# Altium schematic sheet 0.CONNECTOR.SchDoc
size A3
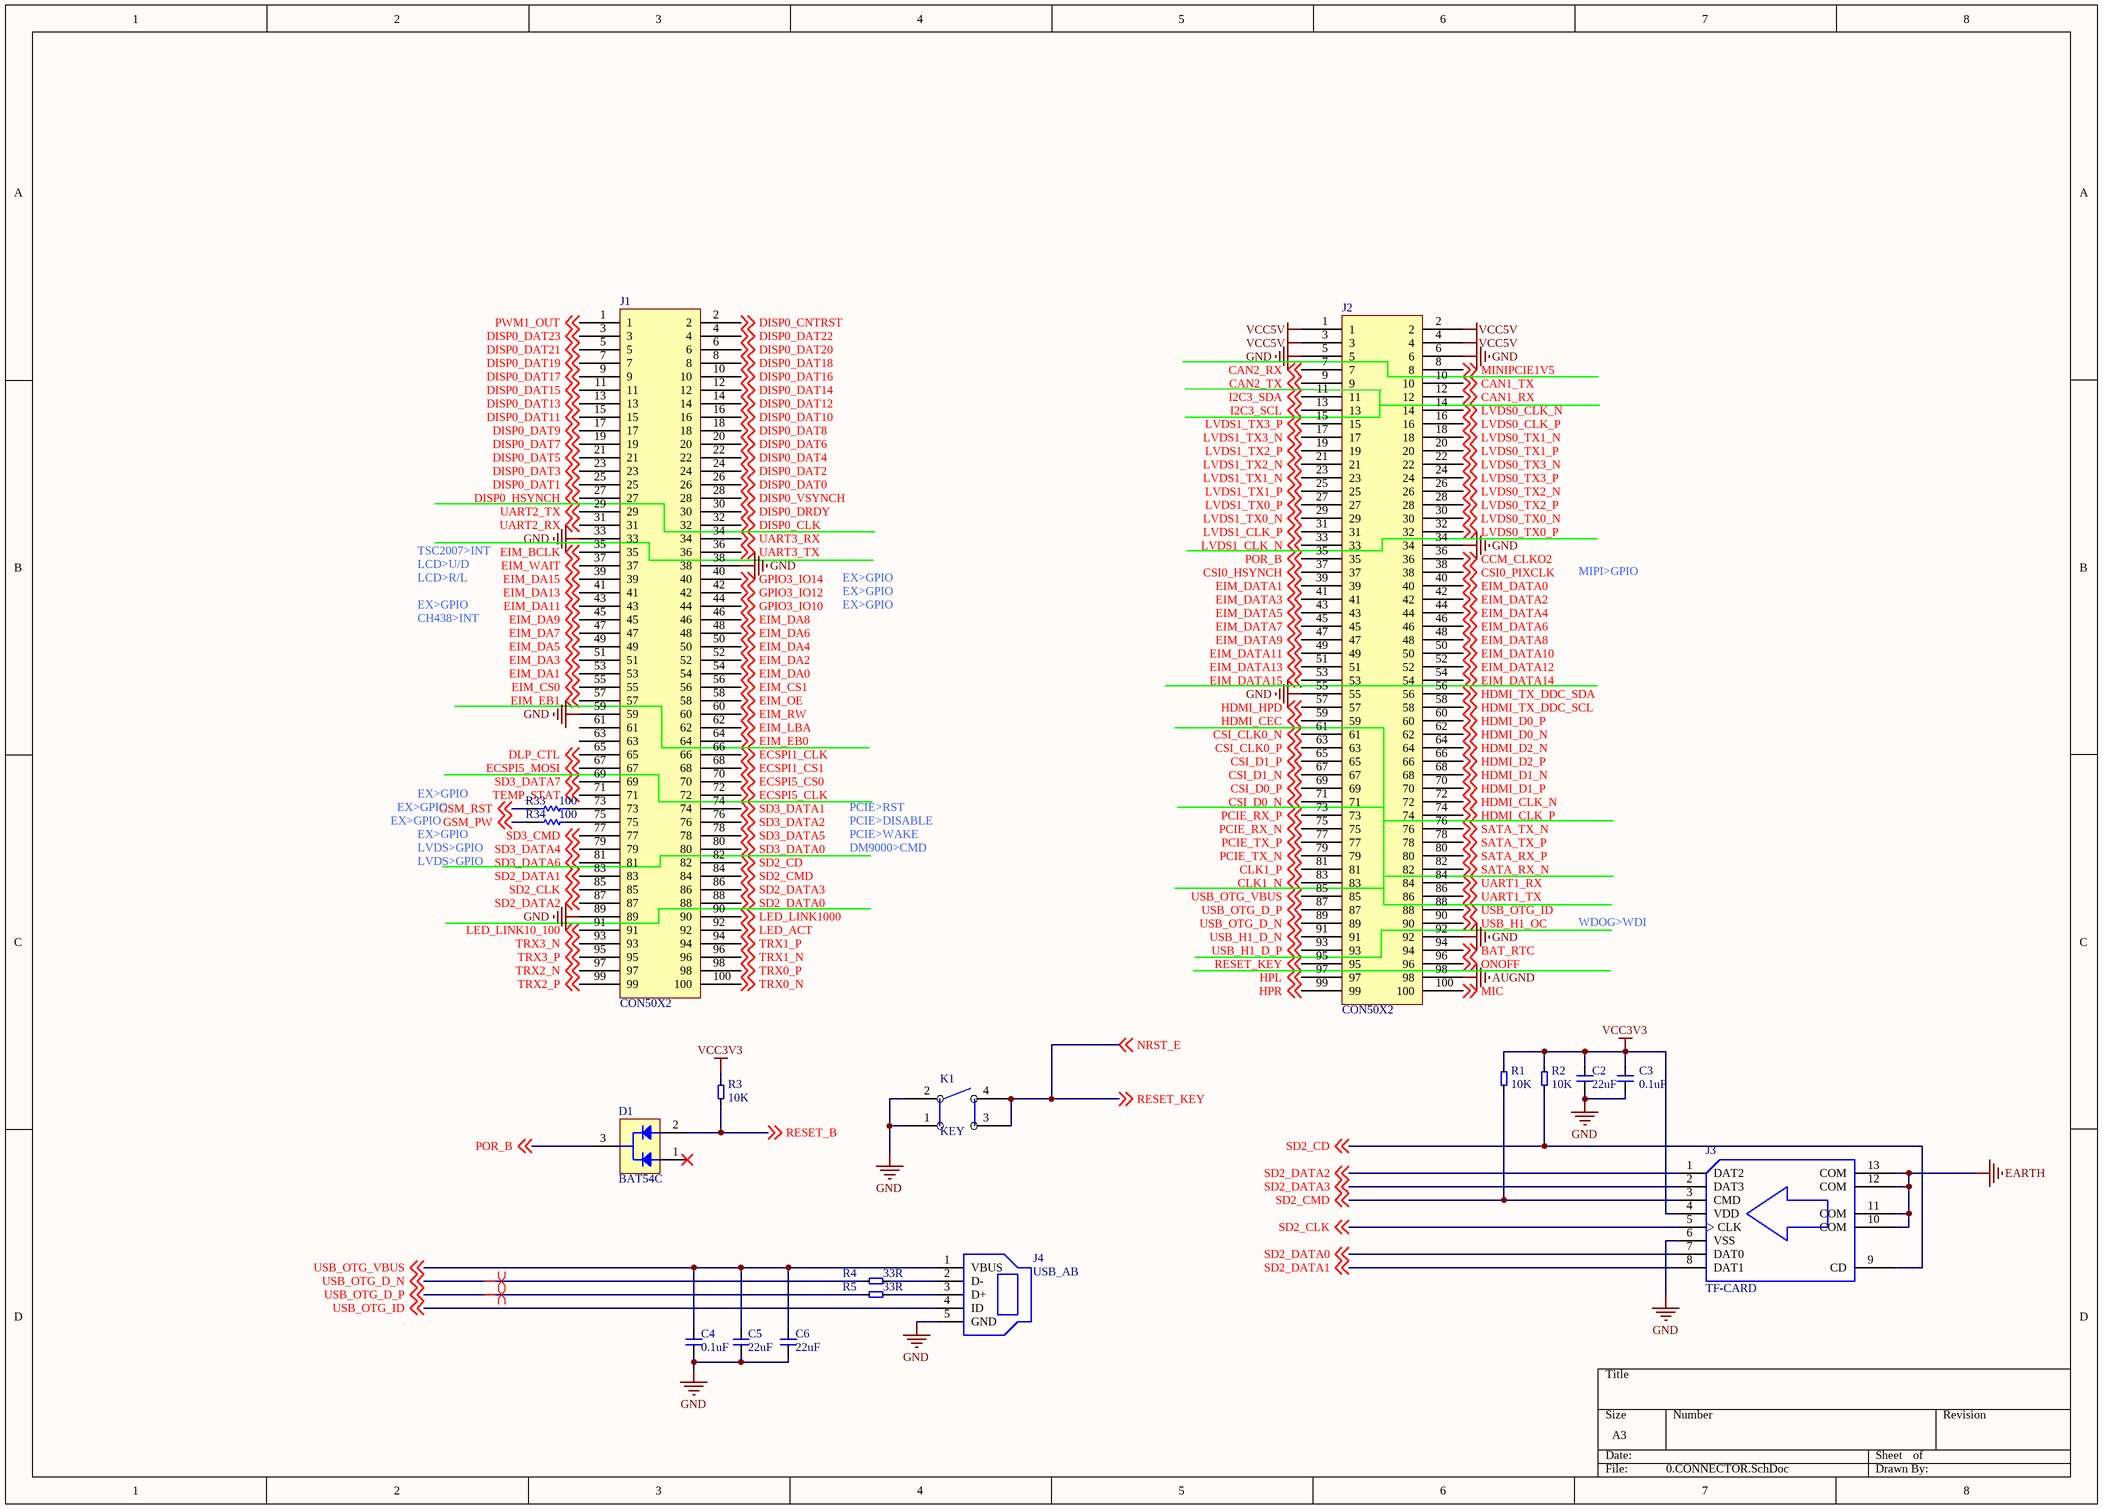
[diagram p0: 0.CONNECTOR.SchDoc]

## Parts
C2  22uF  [0603C]
C3  0.1uF  [0603C]
C4  0.1uF  [0603C]
C5  22uF  [0603C]
C6  22uF  [0603C]
D1  BAT54C  [SOT-23]
J1  CON50X2  [IDC50X2-1.27MM_SMT]
J2  CON50X2  [IDC50X2-1.27MM_SMT]
J3  TF-CARD  [TF-CARD]
J4  USB_AB  [MINI USB B]
K1  KEY  [SS-SPB-4.5]
R1  10K  [0603R]
R2  10K  [0603R]
R3  10K  [0603R]
R4  33R  [0603R]
R5  33R  [0603R]
R33  value 100  [0603]  (hidden comment: Res1)
R34  value 100  [0603]  (hidden comment: Res1)

## Nets
AUGND: J2.98
EARTH: J3.10(COM) J3.11(COM) J3.12(COM) J3.13(COM) J4.6(9) J4.7(9) J4.8(9) J4.9
GND: C2.1 C3.1 C4.1 C5.1 C6.1 J1.33 J1.38 J1.59 J1.89 J2.5 J2.6 J2.34 J2.55 J2.92 J3.6(VSS) J4.5(GND) K1.1 K1.2
VCC3V3: C2.2 C3.2 J3.4(VDD) R1.2 R2.2 R3.2
VCC5V: J2.1 J2.2 J2.3 J2.4
BAT_RTC: J2.94 ; off-sheet BAT_RTC
CAN1_RX: J2.12 ; off-sheet CAN1_RX
CAN1_TX: J2.10 ; off-sheet CAN1_TX
CAN2_RX: J2.7 ; off-sheet CAN2_RX
CAN2_TX: J2.9 ; off-sheet CAN2_TX
CCM_CLKO2: J2.36 ; off-sheet CCM_CLKO2
CLK1_N: J2.83 ; off-sheet CLK1_N
CLK1_P: J2.81 ; off-sheet CLK1_P
CSI0_HSYNCH: J2.37 ; off-sheet CSI0_HSYNCH
CSI0_PIXCLK: J2.38 ; off-sheet CSI0_PIXCLK
CSI_CLK0_N: J2.61 ; off-sheet CSI_CLK0_N
CSI_CLK0_P: J2.63 ; off-sheet CSI_CLK0_P
CSI_D0_N: J2.71 ; off-sheet CSI_D0_N
CSI_D0_P: J2.69 ; off-sheet CSI_D0_P
CSI_D1_N: J2.67 ; off-sheet CSI_D1_N
CSI_D1_P: J2.65 ; off-sheet CSI_D1_P
DISP0_CLK: J1.32 ; off-sheet DISP0_CLK
DISP0_CNTRST: J1.2 ; off-sheet DISP0_CNTRST
DISP0_DAT0: J1.26 ; off-sheet DISP0_DAT0
DISP0_DAT1: J1.25 ; off-sheet DISP0_DAT1
DISP0_DAT2: J1.24 ; off-sheet DISP0_DAT2
DISP0_DAT3: J1.23 ; off-sheet DISP0_DAT3
DISP0_DAT4: J1.22 ; off-sheet DISP0_DAT4
DISP0_DAT5: J1.21 ; off-sheet DISP0_DAT5
DISP0_DAT6: J1.20 ; off-sheet DISP0_DAT6
DISP0_DAT7: J1.19 ; off-sheet DISP0_DAT7
DISP0_DAT8: J1.18 ; off-sheet DISP0_DAT8
DISP0_DAT9: J1.17 ; off-sheet DISP0_DAT9
DISP0_DAT10: J1.16 ; off-sheet DISP0_DAT10
DISP0_DAT11: J1.15 ; off-sheet DISP0_DAT11
DISP0_DAT12: J1.14 ; off-sheet DISP0_DAT12
DISP0_DAT13: J1.13 ; off-sheet DISP0_DAT13
DISP0_DAT14: J1.12 ; off-sheet DISP0_DAT14
DISP0_DAT15: J1.11 ; off-sheet DISP0_DAT15
DISP0_DAT16: J1.10 ; off-sheet DISP0_DAT16
DISP0_DAT17: J1.9 ; off-sheet DISP0_DAT17
DISP0_DAT18: J1.8 ; off-sheet DISP0_DAT18
DISP0_DAT19: J1.7 ; off-sheet DISP0_DAT19
DISP0_DAT20: J1.6 ; off-sheet DISP0_DAT20
DISP0_DAT21: J1.5 ; off-sheet DISP0_DAT21
DISP0_DAT22: J1.4 ; off-sheet DISP0_DAT22
DISP0_DAT23: J1.3 ; off-sheet DISP0_DAT23
DISP0_DRDY: J1.30 ; off-sheet DISP0_DRDY
DISP0_HSYNCH: J1.27 ; off-sheet DISP0_HSYNCH
DISP0_VSYNCH: J1.28 ; off-sheet DISP0_VSYNCH
DLP_CTL: J1.65 ; off-sheet DLP_CTL
ECSPI1_CLK: J1.66 ; off-sheet ECSPI1_CLK
ECSPI1_CS1: J1.68 ; off-sheet ECSPI1_CS1
ECSPI5_CLK: J1.72 ; off-sheet ECSPI5_CLK
ECSPI5_CS0: J1.70 ; off-sheet ECSPI5_CS0
ECSPI5_MOSI: J1.67 ; off-sheet ECSPI5_MOSI
EIM_BCLK: J1.35 ; off-sheet EIM_BCLK
EIM_CS0: J1.55 ; off-sheet EIM_CS0
EIM_CS1: J1.56 ; off-sheet EIM_CS1
EIM_DA0: J1.54 ; off-sheet EIM_DA0
EIM_DA1: J1.53 ; off-sheet EIM_DA1
EIM_DA2: J1.52 ; off-sheet EIM_DA2
EIM_DA3: J1.51 ; off-sheet EIM_DA3
EIM_DA4: J1.50 ; off-sheet EIM_DA4
EIM_DA5: J1.49 ; off-sheet EIM_DA5
EIM_DA6: J1.48 ; off-sheet EIM_DA6
EIM_DA7: J1.47 ; off-sheet EIM_DA7
EIM_DA8: J1.46 ; off-sheet EIM_DA8
EIM_DA9: J1.45 ; off-sheet EIM_DA9
EIM_DA11: J1.43 ; off-sheet EIM_DA11
EIM_DA13: J1.41 ; off-sheet EIM_DA13
EIM_DA15: J1.39 ; off-sheet EIM_DA15
EIM_DATA0: J2.40 ; off-sheet EIM_DATA0
EIM_DATA1: J2.39 ; off-sheet EIM_DATA1
EIM_DATA2: J2.42 ; off-sheet EIM_DATA2
EIM_DATA3: J2.41 ; off-sheet EIM_DATA3
EIM_DATA4: J2.44 ; off-sheet EIM_DATA4
EIM_DATA5: J2.43 ; off-sheet EIM_DATA5
EIM_DATA6: J2.46 ; off-sheet EIM_DATA6
EIM_DATA7: J2.45 ; off-sheet EIM_DATA7
EIM_DATA8: J2.48 ; off-sheet EIM_DATA8
EIM_DATA9: J2.47 ; off-sheet EIM_DATA9
EIM_DATA10: J2.50 ; off-sheet EIM_DATA10
EIM_DATA11: J2.49 ; off-sheet EIM_DATA11
EIM_DATA12: J2.52 ; off-sheet EIM_DATA12
EIM_DATA13: J2.51 ; off-sheet EIM_DATA13
EIM_DATA14: J2.54 ; off-sheet EIM_DATA14
EIM_DATA15: J2.53 ; off-sheet EIM_DATA15
EIM_EB0: J1.64 ; off-sheet EIM_EB0
EIM_EB1: J1.57 ; off-sheet EIM_EB1
EIM_LBA: J1.62 ; off-sheet EIM_LBA
EIM_OE: J1.58 ; off-sheet EIM_OE
EIM_RW: J1.60 ; off-sheet EIM_RW
EIM_WAIT: J1.37 ; off-sheet EIM_WAIT
GPIO3_IO10: J1.44 ; off-sheet GPIO3_IO10
GPIO3_IO12: J1.42 ; off-sheet GPIO3_IO12
GPIO3_IO14: J1.40 ; off-sheet GPIO3_IO14
GSM_PW: R34.2 ; off-sheet GSM_PW
GSM_RST: R33.2 ; off-sheet GSM_RST
HDMI_CEC: J2.59 ; off-sheet HDMI_CEC
HDMI_CLK_N: J2.72 ; off-sheet HDMI_CLK_N
HDMI_CLK_P: J2.74 ; off-sheet HDMI_CLK_P
HDMI_D0_N: J2.62 ; off-sheet HDMI_D0_N
HDMI_D0_P: J2.60 ; off-sheet HDMI_D0_P
HDMI_D1_N: J2.68 ; off-sheet HDMI_D1_N
HDMI_D1_P: J2.70 ; off-sheet HDMI_D1_P
HDMI_D2_N: J2.64 ; off-sheet HDMI_D2_N
HDMI_D2_P: J2.66 ; off-sheet HDMI_D2_P
HDMI_HPD: J2.57 ; off-sheet HDMI_HPD
HDMI_TX_DDC_SCL: J2.58 ; off-sheet HDMI_TX_DDC_SCL
HDMI_TX_DDC_SDA: J2.56 ; off-sheet HDMI_TX_DDC_SDA
HPL: J2.97 ; off-sheet HPL
HPR: J2.99 ; off-sheet HPR
I2C3_SCL: J2.13 ; off-sheet I2C3_SCL
I2C3_SDA: J2.11 ; off-sheet I2C3_SDA
LED_ACT: J1.92 ; off-sheet LED_ACT
LED_LINK10_100: J1.91 ; off-sheet LED_LINK10_100
LED_LINK1000: J1.90 ; off-sheet LED_LINK1000
LVDS0_CLK_N: J2.14 ; off-sheet LVDS0_CLK_N
LVDS0_CLK_P: J2.16 ; off-sheet LVDS0_CLK_P
LVDS0_TX0_N: J2.30 ; off-sheet LVDS0_TX0_N
LVDS0_TX0_P: J2.32 ; off-sheet LVDS0_TX0_P
LVDS0_TX1_N: J2.18 ; off-sheet LVDS0_TX1_N
LVDS0_TX1_P: J2.20 ; off-sheet LVDS0_TX1_P
LVDS0_TX2_N: J2.26 ; off-sheet LVDS0_TX2_N
LVDS0_TX2_P: J2.28 ; off-sheet LVDS0_TX2_P
LVDS0_TX3_N: J2.22 ; off-sheet LVDS0_TX3_N
LVDS0_TX3_P: J2.24 ; off-sheet LVDS0_TX3_P
LVDS1_CLK_N: J2.33 ; off-sheet LVDS1_CLK_N
LVDS1_CLK_P: J2.31 ; off-sheet LVDS1_CLK_P
LVDS1_TX0_N: J2.29 ; off-sheet LVDS1_TX0_N
LVDS1_TX0_P: J2.27 ; off-sheet LVDS1_TX0_P
LVDS1_TX1_N: J2.23 ; off-sheet LVDS1_TX1_N
LVDS1_TX1_P: J2.25 ; off-sheet LVDS1_TX1_P
LVDS1_TX2_N: J2.21 ; off-sheet LVDS1_TX2_N
LVDS1_TX2_P: J2.19 ; off-sheet LVDS1_TX2_P
LVDS1_TX3_N: J2.17 ; off-sheet LVDS1_TX3_N
LVDS1_TX3_P: J2.15 ; off-sheet LVDS1_TX3_P
MIC: J2.100 ; off-sheet MIC
MINIPCIE1V5: J2.8 ; off-sheet MINIPCIE1V5
NRST_E: J2.95 K1.3 K1.4 ; off-sheet RESET_KEY, off-sheet NRST_E  [also labelled RESET_KEY]
ONOFF: J2.96 ; off-sheet ONOFF
PCIE_RX_N: J2.75 ; off-sheet PCIE_RX_N
PCIE_RX_P: J2.73 ; off-sheet PCIE_RX_P
PCIE_TX_N: J2.79 ; off-sheet PCIE_TX_N
PCIE_TX_P: J2.77 ; off-sheet PCIE_TX_P
POR_B: D1.3 J2.35 ; off-sheet POR_B
PWM1_OUT: J1.1 ; off-sheet PWM1_OUT
RESET_B: D1.2 R3.1 ; off-sheet RESET_B
SATA_RX_N: J2.82 ; off-sheet SATA_RX_N
SATA_RX_P: J2.80 ; off-sheet SATA_RX_P
SATA_TX_N: J2.76 ; off-sheet SATA_TX_N
SATA_TX_P: J2.78 ; off-sheet SATA_TX_P
SD2_CD: J1.82 J3.9(CD) R2.1 ; off-sheet SD2_CD
SD2_CLK: J1.85 J3.5(CLK) ; off-sheet SD2_CLK
SD2_CMD: J1.84 J3.3(CMD) R1.1 ; off-sheet SD2_CMD
SD2_DATA0: J1.88 J3.7(DAT0) ; off-sheet SD2_DATA0
SD2_DATA1: J1.83 J3.8(DAT1) ; off-sheet SD2_DATA1
SD2_DATA2: J1.87 J3.1(DAT2) ; off-sheet SD2_DATA2
SD2_DATA3: J1.86 J3.2(DAT3) ; off-sheet SD2_DATA3
SD3_CMD: J1.77 ; off-sheet SD3_CMD
SD3_DATA0: J1.80 ; off-sheet SD3_DATA0
SD3_DATA1: J1.74 ; off-sheet SD3_DATA1
SD3_DATA2: J1.76 ; off-sheet SD3_DATA2
SD3_DATA4: J1.79 ; off-sheet SD3_DATA4
SD3_DATA5: J1.78 ; off-sheet SD3_DATA5
SD3_DATA6: J1.81 ; off-sheet SD3_DATA6
SD3_DATA7: J1.69 ; off-sheet SD3_DATA7
TEMP_STAT: J1.71 ; off-sheet TEMP_STAT
TRX0_N: J1.100 ; off-sheet TRX0_N
TRX0_P: J1.98 ; off-sheet TRX0_P
TRX1_N: J1.96 ; off-sheet TRX1_N
TRX1_P: J1.94 ; off-sheet TRX1_P
TRX2_N: J1.97 ; off-sheet TRX2_N
TRX2_P: J1.99 ; off-sheet TRX2_P
TRX3_N: J1.93 ; off-sheet TRX3_N
TRX3_P: J1.95 ; off-sheet TRX3_P
UART1_RX: J2.84 ; off-sheet UART1_RX
UART1_TX: J2.86 ; off-sheet UART1_TX
UART2_RX: J1.31 ; off-sheet UART2_RX
UART2_TX: J1.29 ; off-sheet UART2_TX
UART3_RX: J1.34 ; off-sheet UART3_RX
UART3_TX: J1.36 ; off-sheet UART3_TX
USB_H1_D_N: J2.91 ; off-sheet USB_H1_D_N
USB_H1_D_P: J2.93 ; off-sheet USB_H1_D_P
USB_H1_OC: J2.90 ; off-sheet USB_H1_OC
USB_OTG_D_N: J2.89 R4.2 ; off-sheet USB_OTG_D_N
USB_OTG_D_P: J2.87 R5.2 ; off-sheet USB_OTG_D_P
USB_OTG_ID: J2.88 J4.4(ID) ; off-sheet USB_OTG_ID
USB_OTG_VBUS: C4.2 C5.2 C6.2 J2.85 J4.1(VBUS) ; off-sheet USB_OTG_VBUS
NetJ1_73: J1.73 R33.1
NetJ1_75: J1.75 R34.1
NetJ4_2: J4.2(D-) R4.1
NetJ4_3: J4.3(D+) R5.1

Not connected (* = marked no-connect by the designer): D1 1*; J1 61 63

## Layout directives
differential pair: USB_OTG_D_N, USB_OTG_D_P

## Notes on the sheet
- TSC2007>INT
- LCD>U/D
- LCD>R/L
- EX>GPIO
- MIPI>GPIO
- CH438>INT
- LVDS>GPIO
- DM9000>CMD
- PCIE>WAKE
- PCIE>DISABLE
- PCIE>RST
- WDOG>WDI

## Library data of the parts
C2-C6 = 电容
D1 = BAT54C: SCHOTTKY DIODE
J1 J2 = CON50X2: ASTRON B2B Connector
J4 = USB_AB: 小USB插痤
K1 = 按键
R1-R5 = 电阻
R33 R34 = Res1: Resistor; Published: 8-Jun-2000; LatestRevisionDate: 17-Jul-2002; LatestRevisionNote: Re-released for DXP Platform.; PackageReference: AXIAL-0.3; Publisher: Altium Limited